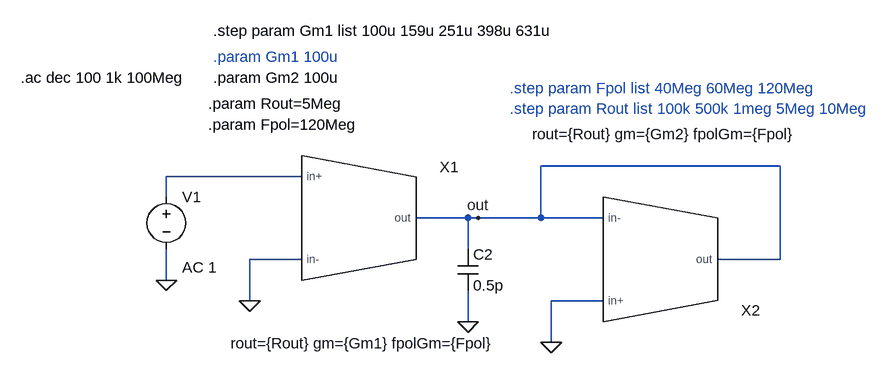
[diagram p0: schematic tb_2GmAmplifier_Gm_model.asc]
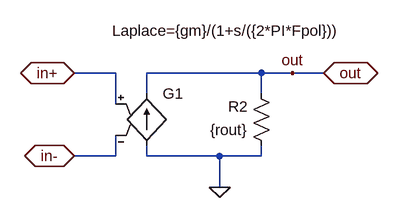
[diagram p1: sub-circuit gm_model.asc]
tb_2GmAmplifier_Gm_model.asc, the LTspice schematic file:
Version 4
SHEET 1 2700 1708
WIRE 704 208 336 208
WIRE -32 224 -240 224
WIRE -240 256 -240 224
WIRE 224 288 144 288
WIRE 240 288 224 288
WIRE 336 288 336 208
WIRE 336 288 240 288
WIRE 432 288 336 288
WIRE 224 336 224 288
WIRE -32 352 -112 352
WIRE 704 352 704 208
WIRE 704 352 608 352
WIRE -240 384 -240 336
WIRE -112 416 -112 352
WIRE 432 416 352 416
WIRE 224 448 224 400
WIRE 352 480 352 416
FLAG -240 384 0
FLAG 240 288 out
FLAG 224 448 0
FLAG -112 416 0
FLAG 352 480 0
SYMBOL voltage -240 240 R0
WINDOW 123 24 124 Left 2
WINDOW 39 0 0 Left 2
SYMATTR Value2 AC 1
SYMATTR InstName V1
SYMATTR Value ""
SYMBOL cap 208 336 R0
SYMATTR InstName C2
SYMATTR Value 0.5p
SYMBOL Gm_model 192 272 R0
WINDOW 39 -128 225 Bottom 2
SYMATTR SpiceLine rout={Rout} gm={Gm1} fpolGm={Fpol}
SYMATTR InstName X1
SYMBOL Gm_model 656 368 M180
WINDOW 39 -128 225 Bottom 2
SYMATTR SpiceLine rout={Rout} gm={Gm2} fpolGm={Fpol}
SYMATTR InstName X2
TEXT -464 72 Left 2 !.ac dec 100 1k 100Meg
TEXT -168 40 Left 2 ;.param Gm1 100u
TEXT -176 112 Left 2 !.param Rout=5Meg
TEXT -176 144 Left 2 !.param Fpol=120Meg
TEXT 288 120 Left 2 ;.step param Rout list 100k 500k 1meg 5Meg 10Meg
TEXT -168 72 Left 2 !.param Gm2 100u
TEXT 288 88 Left 2 ;.step param Fpol list 40Meg 60Meg 120Meg
TEXT -168 0 Left 2 !.step param Gm1 list 100u 159u 251u 398u 631u

gm_model.asc, the sub-circuit schematic file:
Version 4
SHEET 1 2564 1736
WIRE 1248 208 1184 208
WIRE 1472 208 1296 208
WIRE 1520 208 1472 208
WIRE 1568 208 1520 208
WIRE 1296 240 1296 208
WIRE 1472 240 1472 208
WIRE 1248 256 1248 208
WIRE 1248 336 1248 304
WIRE 1248 336 1184 336
WIRE 1296 336 1296 320
WIRE 1408 336 1296 336
WIRE 1472 336 1472 320
WIRE 1472 336 1408 336
WIRE 1408 384 1408 336
FLAG 1520 208 out
FLAG 1568 208 out
IOPIN 1568 208 BiDir
FLAG 1184 208 in+
IOPIN 1184 208 BiDir
FLAG 1184 336 in-
IOPIN 1184 336 BiDir
FLAG 1408 384 0
SYMBOL g 1296 224 R0
WINDOW 3 -53 -81 Left 2
SYMATTR Value Laplace={gm}/(1+s/({2*PI*Fpol}))
SYMATTR InstName G1
SYMBOL res 1488 336 R180
WINDOW 0 36 76 Left 2
WINDOW 3 36 40 Left 2
SYMATTR InstName R2
SYMATTR Value {rout}

The netlist it stands for:
* tb_2GmAmplifier_Gm_model.asc
V1 N001 0 AC 1
C2 out 0 0.5p
XX1 N001 0 out gm_model params: rout={Rout} gm={Gm1} fpolGm={Fpol}
XX2 0 out out gm_model params: rout={Rout} gm={Gm2} fpolGm={Fpol}

* block symbol definitions
.subckt gm_model in+ in- out
G1 0 out in+ in- Laplace={gm}/(1+s/({2*PI*Fpol}))
R2 0 out {rout}
.ends gm_model

.ac dec 100 1k 100Meg
* .param Gm1 100u
.param Rout=5Meg
.param Fpol=120Meg
* .step param Rout list 100k 500k 1meg 5Meg 10Meg
.param Gm2 100u
* .step param Fpol list 40Meg 60Meg 120Meg
.step param Gm1 list 100u 159u 251u 398u 631u
.backanno
.end